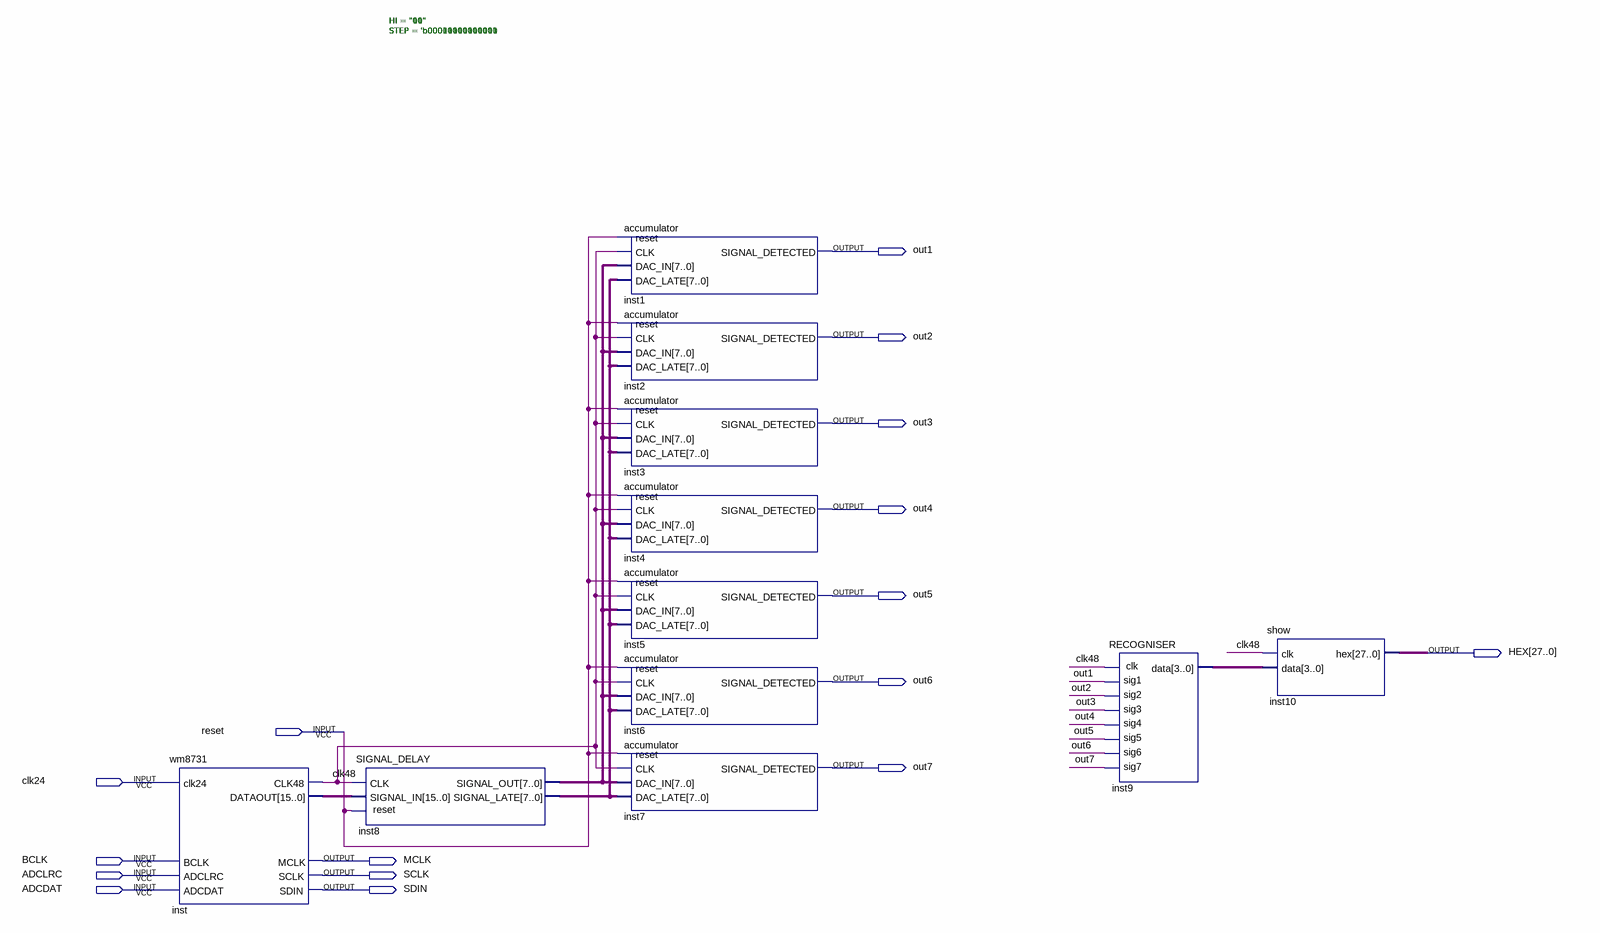
[diagram p0: schematic sheet]
// Quartus schematic dtmf.bdf as structural Verilog: 11 symbols, 16 pins
module dtmf (
  input  reset,
  input  clk24,
  input  BCLK,
  input  ADCLRC,
  input  ADCDAT,
  output out1,
  output out2,
  output out3,
  output out4,
  output out5,
  output [27:0] HEX,
  output out6,
  output out7,
  output MCLK,
  output SCLK,
  output SDIN
);

  wire clk48;
  wire [3:0] inst9_data;
  wire [7:0] inst8_signal_late, inst8_signal_out;
  wire [15:0] inst_dataout;

  wm8731 inst (
    .BCLK(BCLK), .ADCLRC(ADCLRC), .ADCDAT(ADCDAT), .clk24(clk24), .CLK48(clk48), .MCLK(MCLK), .SCLK(SCLK),
    .SDIN(SDIN), .DATAOUT(inst_dataout));
  SIGNAL_DELAY inst8 (
    .CLK(clk48), .reset(reset), .SIGNAL_IN(inst_dataout), .SIGNAL_OUT(inst8_signal_out),
    .SIGNAL_LATE(inst8_signal_late));
  accumulator #(.HI("00"), .STEP('b00001110111000)) inst1 (
    .CLK(clk48), .reset(reset), .DAC_IN(inst8_signal_out), .DAC_LATE(inst8_signal_late),
    .SIGNAL_DETECTED(out1));
  accumulator #(.HI("01"), .STEP('b00010000011011)) inst2 (
    .CLK(clk48), .reset(reset), .DAC_IN(inst8_signal_out), .DAC_LATE(inst8_signal_late),
    .SIGNAL_DETECTED(out2));
  accumulator #(.HI("01"), .STEP('b00010010001011)) inst3 (
    .CLK(clk48), .reset(reset), .DAC_IN(inst8_signal_out), .DAC_LATE(inst8_signal_late),
    .SIGNAL_DETECTED(out3));
  accumulator #(.HI("01"), .STEP('b00010100000101)) inst4 (
    .CLK(clk48), .reset(reset), .DAC_IN(inst8_signal_out), .DAC_LATE(inst8_signal_late),
    .SIGNAL_DETECTED(out4));
  accumulator #(.HI("10"), .STEP('b00011001110011)) inst5 (
    .CLK(clk48), .reset(reset), .DAC_IN(inst8_signal_out), .DAC_LATE(inst8_signal_late),
    .SIGNAL_DETECTED(out5));
  accumulator #(.HI("10"), .STEP('b00011100100000)) inst6 (
    .CLK(clk48), .reset(reset), .DAC_IN(inst8_signal_out), .DAC_LATE(inst8_signal_late),
    .SIGNAL_DETECTED(out6));
  accumulator #(.HI("10"), .STEP('b00011111100001)) inst7 (
    .CLK(clk48), .reset(reset), .DAC_IN(inst8_signal_out), .DAC_LATE(inst8_signal_late),
    .SIGNAL_DETECTED(out7));
  RECOGNISER inst9 (
    .sig1(out1), .sig2(out2), .sig3(out3), .sig4(out4), .sig5(out5), .sig6(out6), .sig7(out7), .clk(clk48),
    .data(inst9_data));
  show inst10 (.clk(clk48), .data(inst9_data), .hex(HEX));
endmodule
